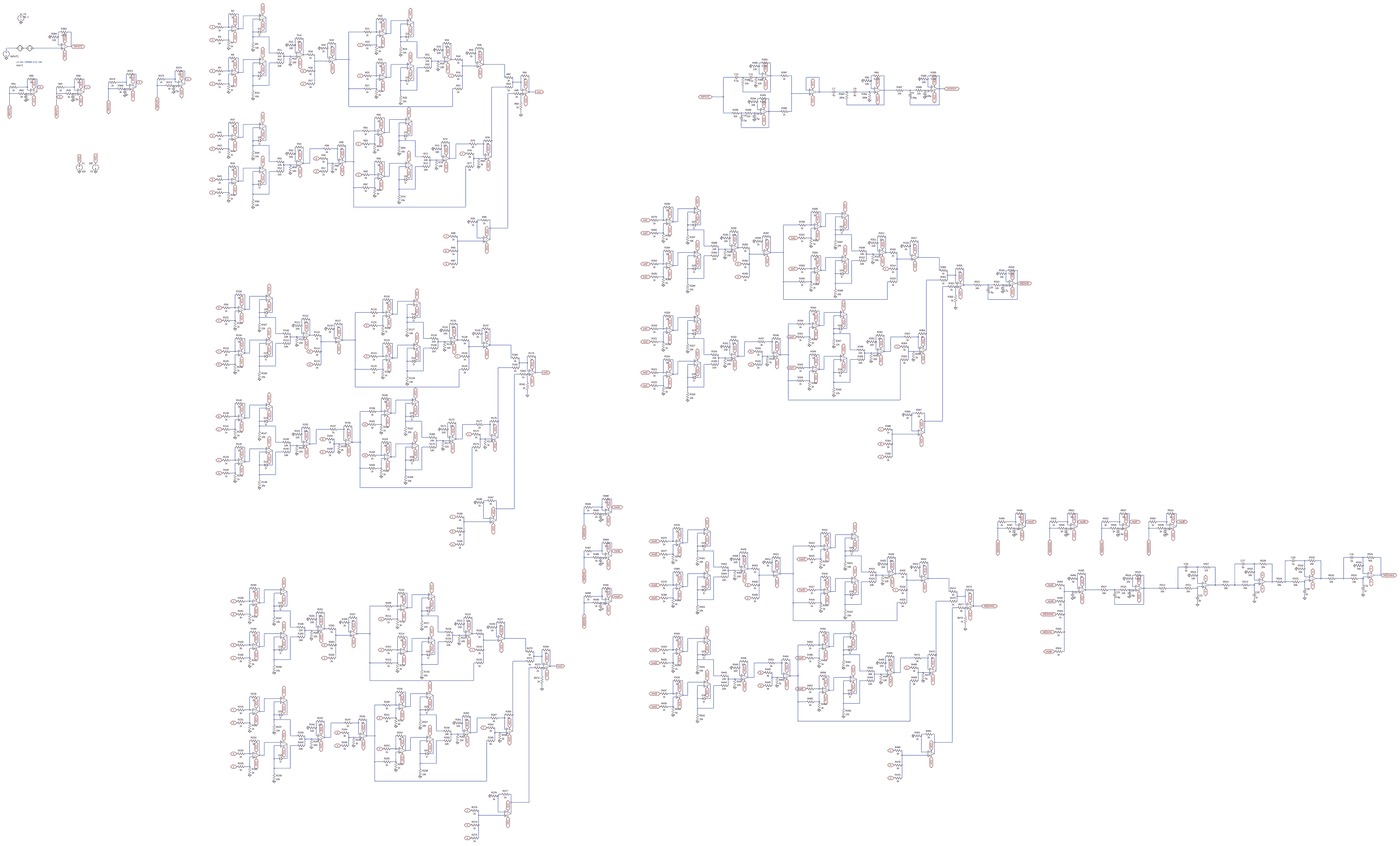
[diagram p0: schematic Median filter best.asc, whole sheet]
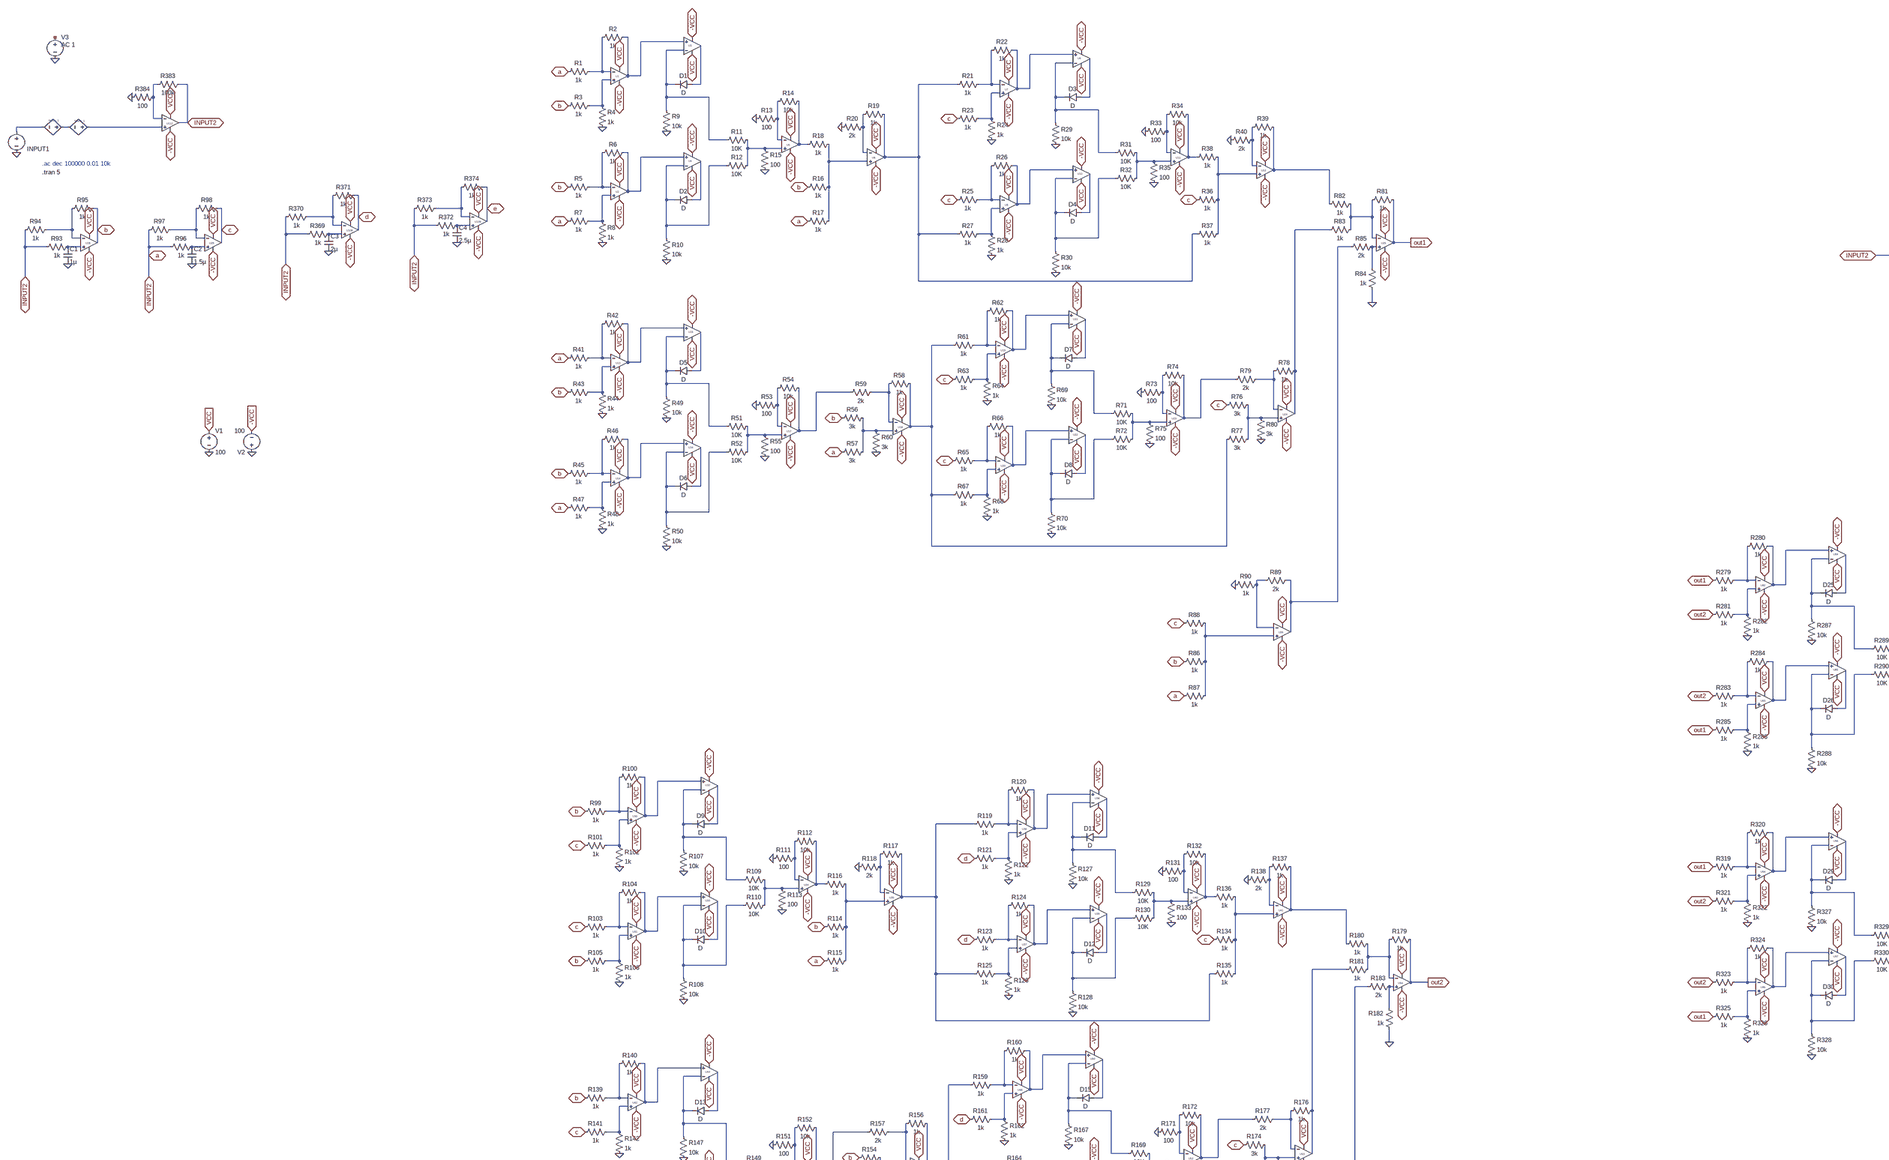
[diagram p1: schematic Median filter best.asc, part, row 1 of 2, column 1 of 2]
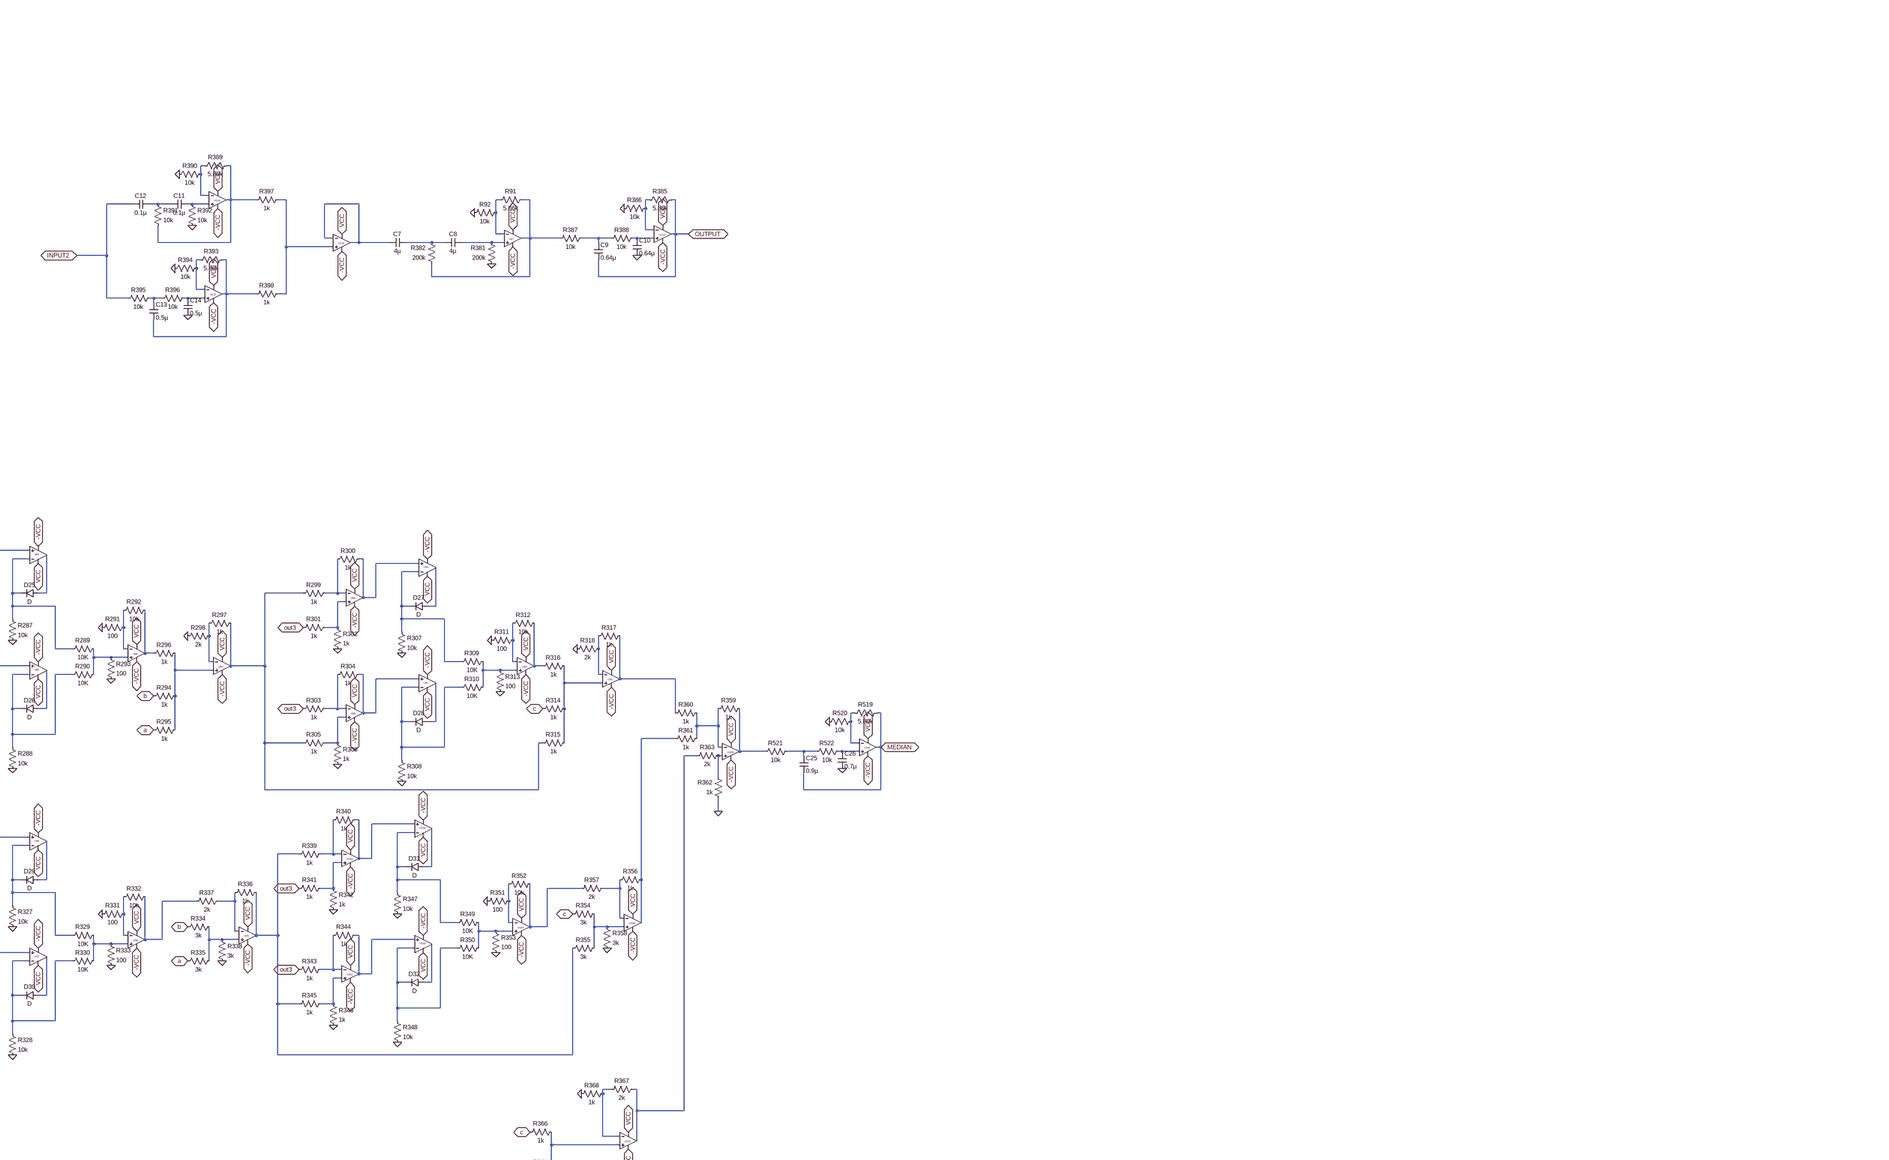
[diagram p2: schematic Median filter best.asc, part, row 1 of 2, column 2 of 2]
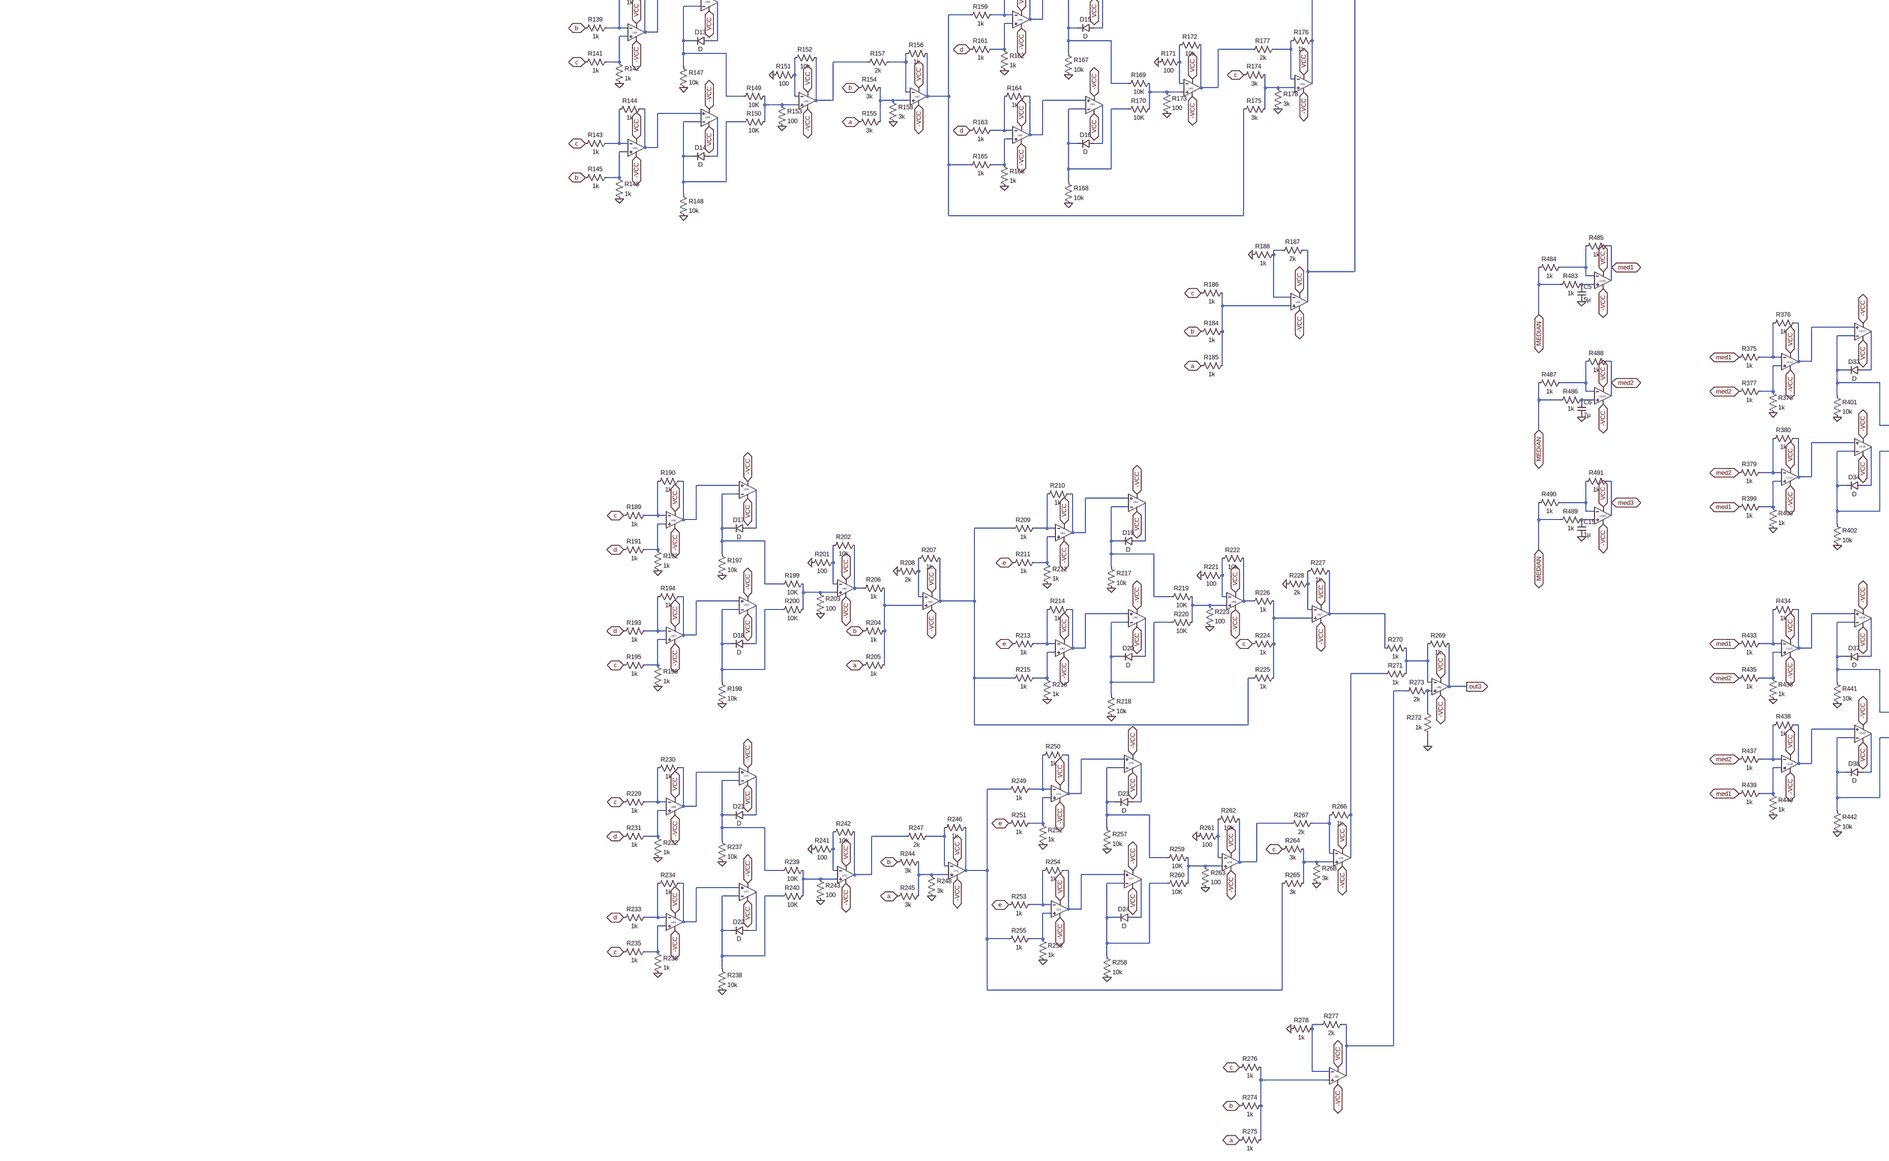
[diagram p3: schematic Median filter best.asc, part, row 2 of 2, column 1 of 2]
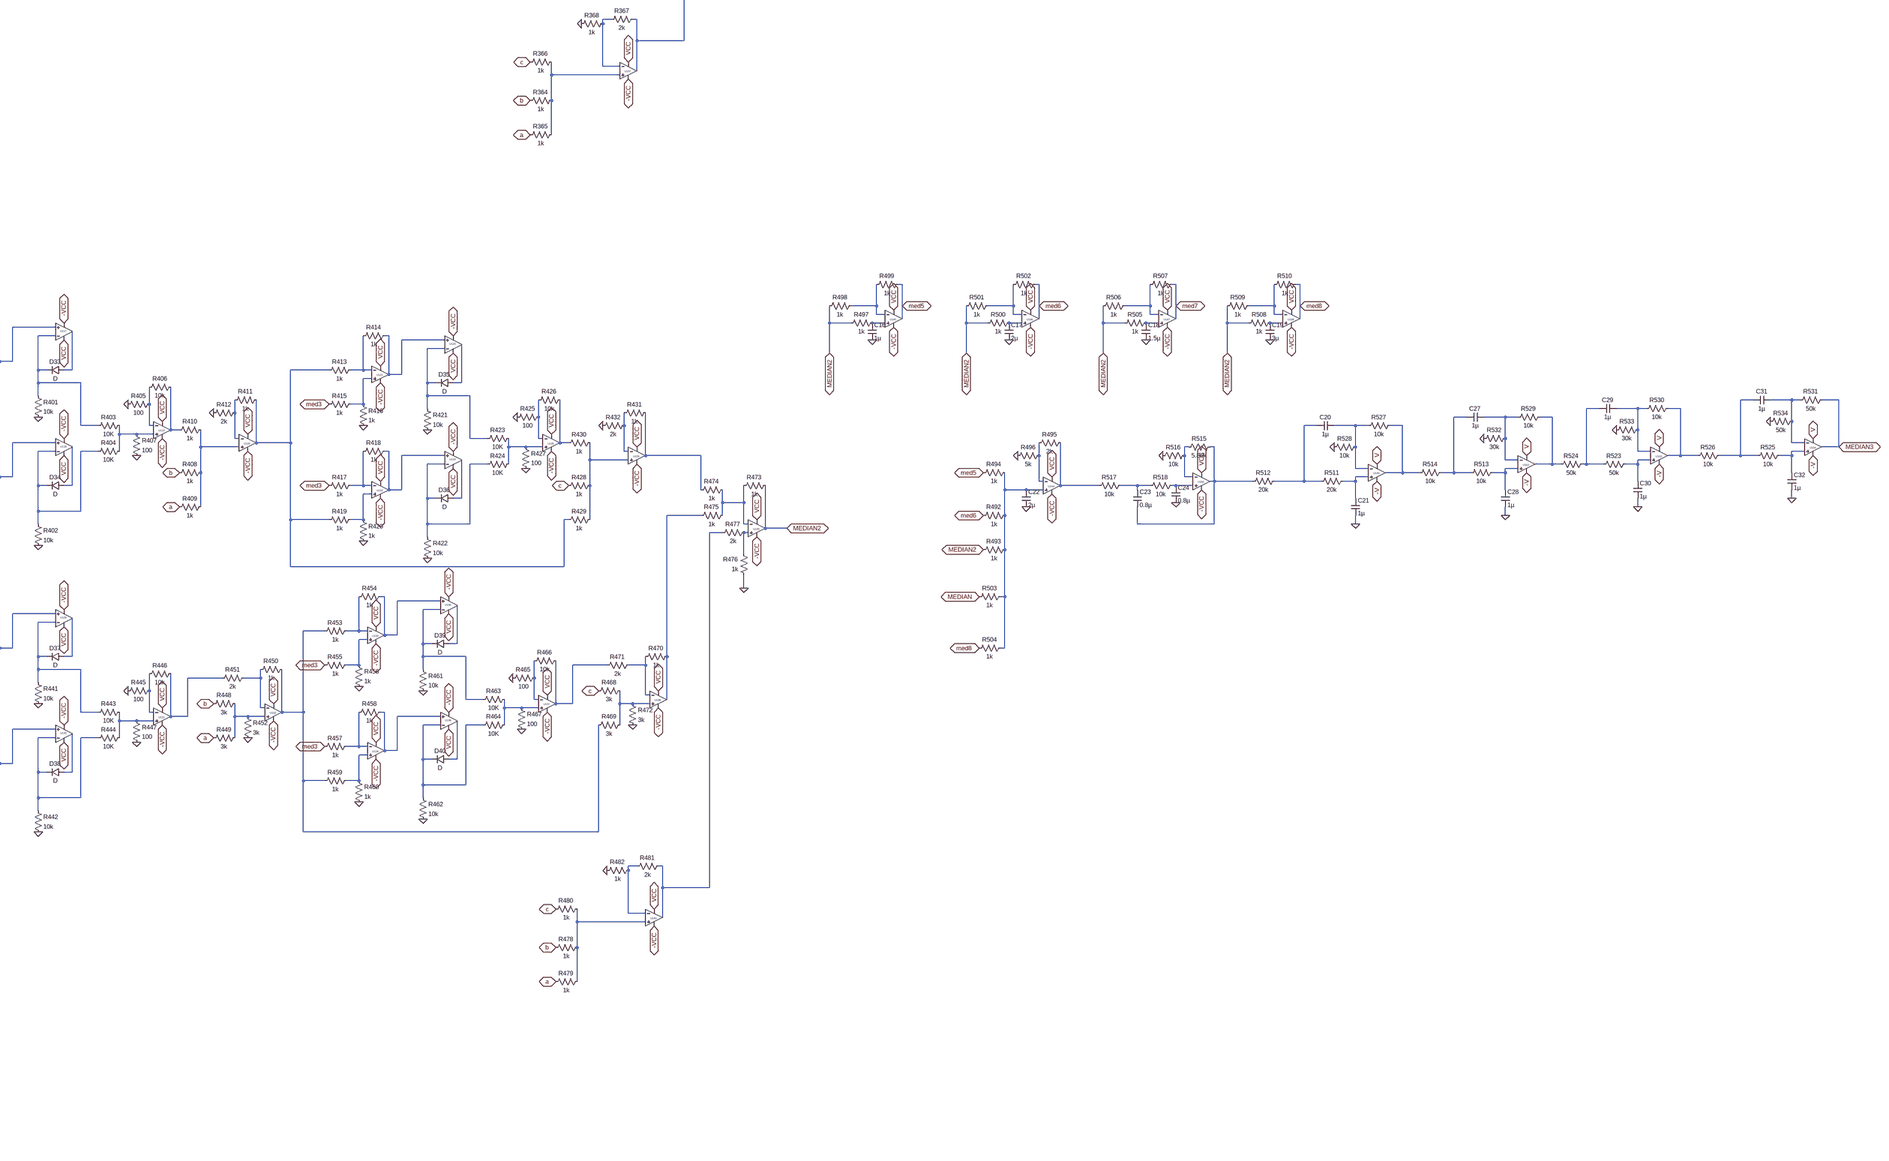
[diagram p4: schematic Median filter best.asc, part, row 2 of 2, column 2 of 2]
* Median filter best.asc
V1 VCC 0 100
V2 0 -VCC 100
XU1 N006 N005 VCC -VCC N001 level2 Avol=1Meg GBW=10Meg Slew=10Meg Ilimit=25m Rail=0 Vos=0 En=0 Enk=0 In=0 Ink=0 Rin=500Meg  ; pins In+ In- V+ V- OUT
R1 N005 INPUT2 1k
R2 N001 N005 1k
R3 N006 b 1k
R4 N006 0 1k
XU2 N034 N033 VCC -VCC N022 level2 Avol=1Meg GBW=10Meg Slew=10Meg Ilimit=25m Rail=0 Vos=0 En=0 Enk=0 In=0 Ink=0 Rin=500Meg  ; pins In+ In- V+ V- OUT
R5 N033 b 1k
R6 N022 N033 1k
R7 N034 INPUT2 1k
R8 N034 0 1k
XU3 N001 N002 VCC -VCC N008 level2 Avol=1Meg GBW=10Meg Slew=10Meg Ilimit=25m Rail=0 Vos=0 En=0 Enk=0 In=0 Ink=0 Rin=500Meg  ; pins In+ In- V+ V- OUT
R9 N002 0 10k
D1 N008 N002 D
XU4 N022 N026 VCC -VCC N035 level2 Avol=1Meg GBW=10Meg Slew=10Meg Ilimit=25m Rail=0 Vos=0 En=0 Enk=0 In=0 Ink=0 Rin=500Meg  ; pins In+ In- V+ V- OUT
R10 N026 0 10k
D2 N035 N026 D
R11 N021 N002 10K
R12 N021 N026 10K
XU5 N021 N013 VCC -VCC N020 level2 Avol=1Meg GBW=10Meg Slew=10Meg Ilimit=25m Rail=0 Vos=0 En=0 Enk=0 In=0 Ink=0 Rin=500Meg  ; pins In+ In- V+ V- OUT
R13 N013 0 100
R14 N020 N013 10k
R15 N021 0 100
R16 N024 b 1k
R17 N024 INPUT2 1k
R18 N024 N020 1k
XU6 N024 N017 VCC -VCC N009 level2 Avol=1Meg GBW=10Meg Slew=10Meg Ilimit=25m Rail=0 Vos=0 En=0 Enk=0 In=0 Ink=0 Rin=500Meg  ; pins In+ In- V+ V- OUT
R19 N009 N017 1k
R20 N017 0 2k
XU7 N011 N010 VCC -VCC N003 level2 Avol=1Meg GBW=10Meg Slew=10Meg Ilimit=25m Rail=0 Vos=0 En=0 Enk=0 In=0 Ink=0 Rin=500Meg  ; pins In+ In- V+ V- OUT
R21 N010 N009 1k
R22 N003 N010 1k
R23 N011 c 1k
R24 N011 0 1k
XU8 N045 N036 VCC -VCC N027 level2 Avol=1Meg GBW=10Meg Slew=10Meg Ilimit=25m Rail=0 Vos=0 En=0 Enk=0 In=0 Ink=0 Rin=500Meg  ; pins In+ In- V+ V- OUT
R25 N036 c 1k
R26 N027 N036 1k
R27 N045 N009 1k
R28 N045 0 1k
XU9 N003 N004 VCC -VCC N012 level2 Avol=1Meg GBW=10Meg Slew=10Meg Ilimit=25m Rail=0 Vos=0 En=0 Enk=0 In=0 Ink=0 Rin=500Meg  ; pins In+ In- V+ V- OUT
R29 N004 0 10k
D3 N012 N004 D
XU10 N027 N032 VCC -VCC N046 level2 Avol=1Meg GBW=10Meg Slew=10Meg Ilimit=25m Rail=0 Vos=0 En=0 Enk=0 In=0 Ink=0 Rin=500Meg  ; pins In+ In- V+ V- OUT
R30 N032 0 10k
D4 N046 N032 D
R31 N025 N004 10K
R32 N025 N032 10K
XU11 N025 N018 VCC -VCC N023 level2 Avol=1Meg GBW=10Meg Slew=10Meg Ilimit=25m Rail=0 Vos=0 En=0 Enk=0 In=0 Ink=0 Rin=500Meg  ; pins In+ In- V+ V- OUT
R33 N018 0 100
R34 N023 N018 10k
R35 N025 0 100
R36 N031 c 1k
R37 N031 N009 1k
R38 N031 N023 1k
XU12 N031 N019 VCC -VCC N030 level2 Avol=1Meg GBW=10Meg Slew=10Meg Ilimit=25m Rail=0 Vos=0 En=0 Enk=0 In=0 Ink=0 Rin=500Meg  ; pins In+ In- V+ V- OUT
R39 N030 N019 1k
R40 N019 0 2k
XU13 N075 N073 VCC -VCC N067 level2 Avol=1Meg GBW=10Meg Slew=10Meg Ilimit=25m Rail=0 Vos=0 En=0 Enk=0 In=0 Ink=0 Rin=500Meg  ; pins In+ In- V+ V- OUT
R41 N073 INPUT2 1k
R42 N067 N073 1k
R43 N075 b 1k
R44 N075 0 1k
XU14 N095 N093 VCC -VCC N088 level2 Avol=1Meg GBW=10Meg Slew=10Meg Ilimit=25m Rail=0 Vos=0 En=0 Enk=0 In=0 Ink=0 Rin=500Meg  ; pins In+ In- V+ V- OUT
R45 N093 b 1k
R46 N088 N093 1k
R47 N095 INPUT2 1k
R48 N095 0 1k
XU15 N067 N069 VCC -VCC N076 level2 Avol=1Meg GBW=10Meg Slew=10Meg Ilimit=25m Rail=0 Vos=0 En=0 Enk=0 In=0 Ink=0 Rin=500Meg  ; pins In+ In- V+ V- OUT
R49 N069 0 10k
D5 N076 N069 D
XU16 N088 N090 VCC -VCC N096 level2 Avol=1Meg GBW=10Meg Slew=10Meg Ilimit=25m Rail=0 Vos=0 En=0 Enk=0 In=0 Ink=0 Rin=500Meg  ; pins In+ In- V+ V- OUT
R50 N090 0 10k
D6 N096 N090 D
R51 N087 N069 10K
R52 N087 N090 10K
XU17 N087 N082 VCC -VCC N079 level2 Avol=1Meg GBW=10Meg Slew=10Meg Ilimit=25m Rail=0 Vos=0 En=0 Enk=0 In=0 Ink=0 Rin=500Meg  ; pins In+ In- V+ V- OUT
R53 N082 0 100
R54 N079 N082 10k
R55 N087 0 100
R56 N086 b 3k
R57 N086 INPUT2 3k
XU18 N086 N080 VCC -VCC N070 level2 Avol=1Meg GBW=10Meg Slew=10Meg Ilimit=25m Rail=0 Vos=0 En=0 Enk=0 In=0 Ink=0 Rin=500Meg  ; pins In+ In- V+ V- OUT
R58 N070 N080 1k
R59 N080 N079 2k
R60 N086 0 3k
XU19 N072 N071 VCC -VCC N066 level2 Avol=1Meg GBW=10Meg Slew=10Meg Ilimit=25m Rail=0 Vos=0 En=0 Enk=0 In=0 Ink=0 Rin=500Meg  ; pins In+ In- V+ V- OUT
R61 N071 N070 1k
R62 N066 N071 1k
R63 N072 c 1k
R64 N072 0 1k
XU20 N092 N091 VCC -VCC N085 level2 Avol=1Meg GBW=10Meg Slew=10Meg Ilimit=25m Rail=0 Vos=0 En=0 Enk=0 In=0 Ink=0 Rin=500Meg  ; pins In+ In- V+ V- OUT
R65 N091 c 1k
R66 N085 N091 1k
R67 N092 N070 1k
R68 N092 0 1k
XU21 N066 N068 VCC -VCC N074 level2 Avol=1Meg GBW=10Meg Slew=10Meg Ilimit=25m Rail=0 Vos=0 En=0 Enk=0 In=0 Ink=0 Rin=500Meg  ; pins In+ In- V+ V- OUT
R69 N068 0 10k
D7 N074 N068 D
XU22 N085 N089 VCC -VCC N094 level2 Avol=1Meg GBW=10Meg Slew=10Meg Ilimit=25m Rail=0 Vos=0 En=0 Enk=0 In=0 Ink=0 Rin=500Meg  ; pins In+ In- V+ V- OUT
R70 N089 0 10k
D8 N094 N089 D
R71 N084 N068 10K
R72 N084 N089 10K
XU23 N084 N081 VCC -VCC N077 level2 Avol=1Meg GBW=10Meg Slew=10Meg Ilimit=25m Rail=0 Vos=0 En=0 Enk=0 In=0 Ink=0 Rin=500Meg  ; pins In+ In- V+ V- OUT
R73 N081 0 100
R74 N077 N081 10k
R75 N084 0 100
R76 N083 c 3k
R77 N083 N070 3k
XU24 N083 N078 VCC -VCC N052 level2 Avol=1Meg GBW=10Meg Slew=10Meg Ilimit=25m Rail=0 Vos=0 En=0 Enk=0 In=0 Ink=0 Rin=500Meg  ; pins In+ In- V+ V- OUT
R78 N052 N078 1k
R79 N078 N077 2k
R80 N083 0 3k
XU25 N061 N048 VCC -VCC out1 level2 Avol=1Meg GBW=10Meg Slew=10Meg Ilimit=25m Rail=0 Vos=0 En=0 Enk=0 In=0 Ink=0 Rin=500Meg  ; pins In+ In- V+ V- OUT
R81 out1 N048 1k
R82 N048 N030 1k
R83 N048 N052 1k
R84 0 N061 1k
R85 N061 N060 2k
XU26 N110 N101 VCC -VCC N060 level2 Avol=1Meg GBW=10Meg Slew=10Meg Ilimit=25m Rail=0 Vos=0 En=0 Enk=0 In=0 Ink=0 Rin=500Meg  ; pins In+ In- V+ V- OUT
R86 N110 b 1k
R87 N110 INPUT2 1k
R88 N110 c 1k
R89 N060 N101 2k
R90 N101 0 1k
XU28 N058 N050 VCC -VCC b level2 Avol=1Meg GBW=10Meg Slew=10Meg Ilimit=25m Rail=0 Vos=0 En=0 Enk=0 In=0 Ink=0 Rin=500Meg  ; pins In+ In- V+ V- OUT
R93 N058 INPUT2 1k
C1 N058 0 1µ
R94 N050 INPUT2 1k
R95 b N050 1k
XU29 N059 N051 VCC -VCC c level2 Avol=1Meg GBW=10Meg Slew=10Meg Ilimit=25m Rail=0 Vos=0 En=0 Enk=0 In=0 Ink=0 Rin=500Meg  ; pins In+ In- V+ V- OUT
R96 N059 INPUT2 1k
C2 N059 0 1.5µ
R97 N051 INPUT2 1k
R98 c N051 1k
XU30 N144 N143 VCC -VCC N139 level2 Avol=1Meg GBW=10Meg Slew=10Meg Ilimit=25m Rail=0 Vos=0 En=0 Enk=0 In=0 Ink=0 Rin=500Meg  ; pins In+ In- V+ V- OUT
R99 N143 b 1k
R100 N139 N143 1k
R101 N144 c 1k
R102 N144 0 1k
XU31 N185 N182 VCC -VCC N169 level2 Avol=1Meg GBW=10Meg Slew=10Meg Ilimit=25m Rail=0 Vos=0 En=0 Enk=0 In=0 Ink=0 Rin=500Meg  ; pins In+ In- V+ V- OUT
R103 N182 c 1k
R104 N169 N182 1k
R105 N185 b 1k
R106 N185 0 1k
XU32 N139 N140 VCC -VCC N146 level2 Avol=1Meg GBW=10Meg Slew=10Meg Ilimit=25m Rail=0 Vos=0 En=0 Enk=0 In=0 Ink=0 Rin=500Meg  ; pins In+ In- V+ V- OUT
R107 N140 0 10k
D9 N146 N140 D
XU33 N169 N176 VCC -VCC N187 level2 Avol=1Meg GBW=10Meg Slew=10Meg Ilimit=25m Rail=0 Vos=0 En=0 Enk=0 In=0 Ink=0 Rin=500Meg  ; pins In+ In- V+ V- OUT
R108 N176 0 10k
D10 N187 N176 D
R109 N166 N140 10K
R110 N166 N176 10K
XU34 N166 N156 VCC -VCC N165 level2 Avol=1Meg GBW=10Meg Slew=10Meg Ilimit=25m Rail=0 Vos=0 En=0 Enk=0 In=0 Ink=0 Rin=500Meg  ; pins In+ In- V+ V- OUT
R111 N156 0 100
R112 N165 N156 10k
R113 N166 0 100
R114 N171 b 1k
R115 N171 INPUT2 1k
R116 N171 N165 1k
XU35 N171 N158 VCC -VCC N147 level2 Avol=1Meg GBW=10Meg Slew=10Meg Ilimit=25m Rail=0 Vos=0 En=0 Enk=0 In=0 Ink=0 Rin=500Meg  ; pins In+ In- V+ V- OUT
R117 N147 N158 1k
R118 N158 0 2k
XU36 N149 N148 VCC -VCC N141 level2 Avol=1Meg GBW=10Meg Slew=10Meg Ilimit=25m Rail=0 Vos=0 En=0 Enk=0 In=0 Ink=0 Rin=500Meg  ; pins In+ In- V+ V- OUT
R119 N148 N147 1k
R120 N141 N148 1k
R121 N149 d 1k
R122 N149 0 1k
XU37 N191 N188 VCC -VCC N177 level2 Avol=1Meg GBW=10Meg Slew=10Meg Ilimit=25m Rail=0 Vos=0 En=0 Enk=0 In=0 Ink=0 Rin=500Meg  ; pins In+ In- V+ V- OUT
R123 N188 d 1k
R124 N177 N188 1k
R125 N191 N147 1k
R126 N191 0 1k
XU38 N141 N142 VCC -VCC N152 level2 Avol=1Meg GBW=10Meg Slew=10Meg Ilimit=25m Rail=0 Vos=0 En=0 Enk=0 In=0 Ink=0 Rin=500Meg  ; pins In+ In- V+ V- OUT
R127 N142 0 10k
D11 N152 N142 D
XU39 N177 N181 VCC -VCC N194 level2 Avol=1Meg GBW=10Meg Slew=10Meg Ilimit=25m Rail=0 Vos=0 En=0 Enk=0 In=0 Ink=0 Rin=500Meg  ; pins In+ In- V+ V- OUT
R128 N181 0 10k
D12 N194 N181 D
R129 N172 N142 10K
R130 N172 N181 10K
XU40 N172 N161 VCC -VCC N170 level2 Avol=1Meg GBW=10Meg Slew=10Meg Ilimit=25m Rail=0 Vos=0 En=0 Enk=0 In=0 Ink=0 Rin=500Meg  ; pins In+ In- V+ V- OUT
R131 N161 0 100
R132 N170 N161 10k
R133 N172 0 100
R134 N179 c 1k
R135 N179 N147 1k
R136 N179 N170 1k
XU41 N179 N163 VCC -VCC N178 level2 Avol=1Meg GBW=10Meg Slew=10Meg Ilimit=25m Rail=0 Vos=0 En=0 Enk=0 In=0 Ink=0 Rin=500Meg  ; pins In+ In- V+ V- OUT
R137 N178 N163 1k
R138 N163 0 2k
XU42 N216 N214 VCC -VCC N207 level2 Avol=1Meg GBW=10Meg Slew=10Meg Ilimit=25m Rail=0 Vos=0 En=0 Enk=0 In=0 Ink=0 Rin=500Meg  ; pins In+ In- V+ V- OUT
R139 N214 b 1k
R140 N207 N214 1k
R141 N216 c 1k
R142 N216 0 1k
XU43 N237 N235 VCC -VCC N230 level2 Avol=1Meg GBW=10Meg Slew=10Meg Ilimit=25m Rail=0 Vos=0 En=0 Enk=0 In=0 Ink=0 Rin=500Meg  ; pins In+ In- V+ V- OUT
R143 N235 c 1k
R144 N230 N235 1k
R145 N237 b 1k
R146 N237 0 1k
XU44 N207 N209 VCC -VCC N217 level2 Avol=1Meg GBW=10Meg Slew=10Meg Ilimit=25m Rail=0 Vos=0 En=0 Enk=0 In=0 Ink=0 Rin=500Meg  ; pins In+ In- V+ V- OUT
R147 N209 0 10k
D13 N217 N209 D
XU45 N230 N232 VCC -VCC N238 level2 Avol=1Meg GBW=10Meg Slew=10Meg Ilimit=25m Rail=0 Vos=0 En=0 Enk=0 In=0 Ink=0 Rin=500Meg  ; pins In+ In- V+ V- OUT
R148 N232 0 10k
D14 N238 N232 D
R149 N229 N209 10K
R150 N229 N232 10K
XU46 N229 N223 VCC -VCC N220 level2 Avol=1Meg GBW=10Meg Slew=10Meg Ilimit=25m Rail=0 Vos=0 En=0 Enk=0 In=0 Ink=0 Rin=500Meg  ; pins In+ In- V+ V- OUT
R151 N223 0 100
R152 N220 N223 10k
R153 N229 0 100
R154 N228 b 3k
R155 N228 INPUT2 3k
XU47 N228 N221 VCC -VCC N210 level2 Avol=1Meg GBW=10Meg Slew=10Meg Ilimit=25m Rail=0 Vos=0 En=0 Enk=0 In=0 Ink=0 Rin=500Meg  ; pins In+ In- V+ V- OUT
R156 N210 N221 1k
R157 N221 N220 2k
R158 N228 0 3k
XU48 N213 N211 VCC -VCC N206 level2 Avol=1Meg GBW=10Meg Slew=10Meg Ilimit=25m Rail=0 Vos=0 En=0 Enk=0 In=0 Ink=0 Rin=500Meg  ; pins In+ In- V+ V- OUT
R159 N211 N210 1k
R160 N206 N211 1k
R161 N213 d 1k
R162 N213 0 1k
XU49 N234 N233 VCC -VCC N227 level2 Avol=1Meg GBW=10Meg Slew=10Meg Ilimit=25m Rail=0 Vos=0 En=0 Enk=0 In=0 Ink=0 Rin=500Meg  ; pins In+ In- V+ V- OUT
R163 N233 d 1k
R164 N227 N233 1k
R165 N234 N210 1k
R166 N234 0 1k
XU50 N206 N208 VCC -VCC N215 level2 Avol=1Meg GBW=10Meg Slew=10Meg Ilimit=25m Rail=0 Vos=0 En=0 Enk=0 In=0 Ink=0 Rin=500Meg  ; pins In+ In- V+ V- OUT
R167 N208 0 10k
D15 N215 N208 D
XU51 N227 N231 VCC -VCC N236 level2 Avol=1Meg GBW=10Meg Slew=10Meg Ilimit=25m Rail=0 Vos=0 En=0 Enk=0 In=0 Ink=0 Rin=500Meg  ; pins In+ In- V+ V- OUT
R168 N231 0 10k
D16 N236 N231 D
R169 N226 N208 10K
R170 N226 N231 10K
XU52 N226 N222 VCC -VCC N218 level2 Avol=1Meg GBW=10Meg Slew=10Meg Ilimit=25m Rail=0 Vos=0 En=0 Enk=0 In=0 Ink=0 Rin=500Meg  ; pins In+ In- V+ V- OUT
R171 N222 0 100
R172 N218 N222 10k
R173 N226 0 100
R174 N225 c 3k
R175 N225 N210 3k
XU53 N225 N219 VCC -VCC N197 level2 Avol=1Meg GBW=10Meg Slew=10Meg Ilimit=25m Rail=0 Vos=0 En=0 Enk=0 In=0 Ink=0 Rin=500Meg  ; pins In+ In- V+ V- OUT
R176 N197 N219 1k
R177 N219 N218 2k
R178 N225 0 3k
XU54 N203 N195 VCC -VCC out2 level2 Avol=1Meg GBW=10Meg Slew=10Meg Ilimit=25m Rail=0 Vos=0 En=0 Enk=0 In=0 Ink=0 Rin=500Meg  ; pins In+ In- V+ V- OUT
R179 out2 N195 1k
R180 N195 N178 1k
R181 N195 N197 1k
R182 0 N203 1k
R183 N203 N202 2k
XU55 N242 N239 VCC -VCC N202 level2 Avol=1Meg GBW=10Meg Slew=10Meg Ilimit=25m Rail=0 Vos=0 En=0 Enk=0 In=0 Ink=0 Rin=500Meg  ; pins In+ In- V+ V- OUT
R184 N242 b 1k
R185 N242 INPUT2 1k
R186 N242 c 1k
R187 N202 N239 2k
R188 N239 0 1k
XU56 N316 N313 VCC -VCC N298 level2 Avol=1Meg GBW=10Meg Slew=10Meg Ilimit=25m Rail=0 Vos=0 En=0 Enk=0 In=0 Ink=0 Rin=500Meg  ; pins In+ In- V+ V- OUT
R189 N313 c 1k
R190 N298 N313 1k
R191 N316 d 1k
R192 N316 0 1k
XU57 N346 N343 VCC -VCC N330 level2 Avol=1Meg GBW=10Meg Slew=10Meg Ilimit=25m Rail=0 Vos=0 En=0 Enk=0 In=0 Ink=0 Rin=500Meg  ; pins In+ In- V+ V- OUT
R193 N343 d 1k
R194 N330 N343 1k
R195 N346 c 1k
R196 N346 0 1k
XU58 N298 N306 VCC -VCC N317 level2 Avol=1Meg GBW=10Meg Slew=10Meg Ilimit=25m Rail=0 Vos=0 En=0 Enk=0 In=0 Ink=0 Rin=500Meg  ; pins In+ In- V+ V- OUT
R197 N306 0 10k
D17 N317 N306 D
XU59 N330 N335 VCC -VCC N348 level2 Avol=1Meg GBW=10Meg Slew=10Meg Ilimit=25m Rail=0 Vos=0 En=0 Enk=0 In=0 Ink=0 Rin=500Meg  ; pins In+ In- V+ V- OUT
R198 N335 0 10k
D18 N348 N335 D
R199 N329 N306 10K
R200 N329 N335 10K
XU60 N329 N324 VCC -VCC N328 level2 Avol=1Meg GBW=10Meg Slew=10Meg Ilimit=25m Rail=0 Vos=0 En=0 Enk=0 In=0 Ink=0 Rin=500Meg  ; pins In+ In- V+ V- OUT
R201 N324 0 100
R202 N328 N324 10k
R203 N329 0 100
R204 N333 b 1k
R205 N333 INPUT2 1k
R206 N333 N328 1k
XU61 N333 N325 VCC -VCC N318 level2 Avol=1Meg GBW=10Meg Slew=10Meg Ilimit=25m Rail=0 Vos=0 En=0 Enk=0 In=0 Ink=0 Rin=500Meg  ; pins In+ In- V+ V- OUT
R207 N318 N325 1k
R208 N325 0 2k
XU62 N322 N319 VCC -VCC N307 level2 Avol=1Meg GBW=10Meg Slew=10Meg Ilimit=25m Rail=0 Vos=0 En=0 Enk=0 In=0 Ink=0 Rin=500Meg  ; pins In+ In- V+ V- OUT
R209 N319 N318 1k
R210 N307 N319 1k
R211 N322 e 1k
R212 N322 0 1k
XU63 N352 N349 VCC -VCC N336 level2 Avol=1Meg GBW=10Meg Slew=10Meg Ilimit=25m Rail=0 Vos=0 En=0 Enk=0 In=0 Ink=0 Rin=500Meg  ; pins In+ In- V+ V- OUT
R213 N349 e 1k
R214 N336 N349 1k
R215 N352 N318 1k
R216 N352 0 1k
XU64 N307 N312 VCC -VCC N323 level2 Avol=1Meg GBW=10Meg Slew=10Meg Ilimit=25m Rail=0 Vos=0 En=0 Enk=0 In=0 Ink=0 Rin=500Meg  ; pins In+ In- V+ V- OUT
R217 N312 0 10k
D19 N323 N312 D
XU65 N336 N341 VCC -VCC N354 level2 Avol=1Meg GBW=10Meg Slew=10Meg Ilimit=25m Rail=0 Vos=0 En=0 Enk=0 In=0 Ink=0 Rin=500Meg  ; pins In+ In- V+ V- OUT
R218 N341 0 10k
D20 N354 N341 D
R219 N334 N312 10K
R220 N334 N341 10K
XU66 N334 N326 VCC -VCC N332 level2 Avol=1Meg GBW=10Meg Slew=10Meg Ilimit=25m Rail=0 Vos=0 En=0 Enk=0 In=0 Ink=0 Rin=500Meg  ; pins In+ In- V+ V- OUT
R221 N326 0 100
R222 N332 N326 10k
R223 N334 0 100
R224 N340 c 1k
R225 N340 N318 1k
R226 N340 N332 1k
XU67 N340 N327 VCC -VCC N339 level2 Avol=1Meg GBW=10Meg Slew=10Meg Ilimit=25m Rail=0 Vos=0 En=0 Enk=0 In=0 Ink=0 Rin=500Meg  ; pins In+ In- V+ V- OUT
R227 N339 N327 1k
R228 N327 0 2k
XU68 N389 N387 VCC -VCC N379 level2 Avol=1Meg GBW=10Meg Slew=10Meg Ilimit=25m Rail=0 Vos=0 En=0 Enk=0 In=0 Ink=0 Rin=500Meg  ; pins In+ In- V+ V- OUT
R229 N387 c 1k
R230 N379 N387 1k
R231 N389 d 1k
R232 N389 0 1k
XU69 N411 N408 VCC -VCC N403 level2 Avol=1Meg GBW=10Meg Slew=10Meg Ilimit=25m Rail=0 Vos=0 En=0 Enk=0 In=0 Ink=0 Rin=500Meg  ; pins In+ In- V+ V- OUT
R233 N408 d 1k
R234 N403 N408 1k
R235 N411 c 1k
R236 N411 0 1k
XU70 N379 N383 VCC -VCC N390 level2 Avol=1Meg GBW=10Meg Slew=10Meg Ilimit=25m Rail=0 Vos=0 En=0 Enk=0 In=0 Ink=0 Rin=500Meg  ; pins In+ In- V+ V- OUT
R237 N383 0 10k
D21 N390 N383 D
XU71 N403 N405 VCC -VCC N412 level2 Avol=1Meg GBW=10Meg Slew=10Meg Ilimit=25m Rail=0 Vos=0 En=0 Enk=0 In=0 Ink=0 Rin=500Meg  ; pins In+ In- V+ V- OUT
R238 N405 0 10k
D22 N412 N405 D
R239 N402 N383 10K
R240 N402 N405 10K
XU72 N402 N396 VCC -VCC N393 level2 Avol=1Meg GBW=10Meg Slew=10Meg Ilimit=25m Rail=0 Vos=0 En=0 Enk=0 In=0 Ink=0 Rin=500Meg  ; pins In+ In- V+ V- OUT
R241 N396 0 100
R242 N393 N396 10k
R243 N402 0 100
R244 N401 b 3k
R245 N401 INPUT2 3k
XU73 N401 N394 VCC -VCC N384 level2 Avol=1Meg GBW=10Meg Slew=10Meg Ilimit=25m Rail=0 Vos=0 En=0 Enk=0 In=0 Ink=0 Rin=500Meg  ; pins In+ In- V+ V- OUT
R246 N384 N394 1k
R247 N394 N393 2k
R248 N401 0 3k
XU74 N386 N385 VCC -VCC N375 level2 Avol=1Meg GBW=10Meg Slew=10Meg Ilimit=25m Rail=0 Vos=0 En=0 Enk=0 In=0 Ink=0 Rin=500Meg  ; pins In+ In- V+ V- OUT
R249 N385 N384 1k
R250 N375 N385 1k
R251 N386 e 1k
R252 N386 0 1k
XU75 N407 N406 VCC -VCC N400 level2 Avol=1Meg GBW=10Meg Slew=10Meg Ilimit=25m Rail=0 Vos=0 En=0 Enk=0 In=0 Ink=0 Rin=500Meg  ; pins In+ In- V+ V- OUT
R253 N406 e 1k
R254 N400 N406 1k
R255 N407 N384 1k
R256 N407 0 1k
XU76 N375 N380 VCC -VCC N388 level2 Avol=1Meg GBW=10Meg Slew=10Meg Ilimit=25m Rail=0 Vos=0 En=0 Enk=0 In=0 Ink=0 Rin=500Meg  ; pins In+ In- V+ V- OUT
R257 N380 0 10k
D23 N388 N380 D
XU77 N400 N404 VCC -VCC N409 level2 Avol=1Meg GBW=10Meg Slew=10Meg Ilimit=25m Rail=0 Vos=0 En=0 Enk=0 In=0 Ink=0 Rin=500Meg  ; pins In+ In- V+ V- OUT
R258 N404 0 10k
D24 N409 N404 D
R259 N398 N380 10K
R260 N398 N404 10K
XU78 N398 N395 VCC -VCC N391 level2 Avol=1Meg GBW=10Meg Slew=10Meg Ilimit=25m Rail=0 Vos=0 En=0 Enk=0 In=0 Ink=0 Rin=500Meg  ; pins In+ In- V+ V- OUT
R261 N395 0 100
R262 N391 N395 10k
R263 N398 0 100
R264 N397 c 3k
R265 N397 N384 3k
XU79 N397 N392 VCC -VCC N359 level2 Avol=1Meg GBW=10Meg Slew=10Meg Ilimit=25m Rail=0 Vos=0 En=0 Enk=0 In=0 Ink=0 Rin=500Meg  ; pins In+ In- V+ V- OUT
R266 N359 N392 1k
R267 N392 N391 2k
R268 N397 0 3k
XU80 N364 N356 VCC -VCC out3 level2 Avol=1Meg GBW=10Meg Slew=10Meg Ilimit=25m Rail=0 Vos=0 En=0 Enk=0 In=0 Ink=0 Rin=500Meg  ; pins In+ In- V+ V- OUT
R269 out3 N356 1k
R270 N356 N339 1k
R271 N356 N359 1k
R272 0 N364 1k
R273 N364 N363 2k
XU81 N414 N413 VCC -VCC N363 level2 Avol=1Meg GBW=10Meg Slew=10Meg Ilimit=25m Rail=0 Vos=0 En=0 Enk=0 In=0 Ink=0 Rin=500Meg  ; pins In+ In- V+ V- OUT
R274 N414 b 1k
R275 N414 INPUT2 1k
R276 N414 c 1k
R277 N363 N413 2k
R278 N413 0 1k
XU82 N103 N102 VCC -VCC N097 level2 Avol=1Meg GBW=10Meg Slew=10Meg Ilimit=25m Rail=0 Vos=0 En=0 Enk=0 In=0 Ink=0 Rin=500Meg  ; pins In+ In- V+ V- OUT
R279 N102 out1 1k
R280 N097 N102 1k
R281 N103 out2 1k
R282 N103 0 1k
XU83 N126 N125 VCC -VCC N116 level2 Avol=1Meg GBW=10Meg Slew=10Meg Ilimit=25m Rail=0 Vos=0 En=0 Enk=0 In=0 Ink=0 Rin=500Meg  ; pins In+ In- V+ V- OUT
R283 N125 out2 1k
R284 N116 N125 1k
R285 N126 out1 1k
R286 N126 0 1k
XU84 N097 N098 VCC -VCC N104 level2 Avol=1Meg GBW=10Meg Slew=10Meg Ilimit=25m Rail=0 Vos=0 En=0 Enk=0 In=0 Ink=0 Rin=500Meg  ; pins In+ In- V+ V- OUT
R287 N098 0 10k
D25 N104 N098 D
XU85 N116 N120 VCC -VCC N127 level2 Avol=1Meg GBW=10Meg Slew=10Meg Ilimit=25m Rail=0 Vos=0 En=0 Enk=0 In=0 Ink=0 Rin=500Meg  ; pins In+ In- V+ V- OUT
R288 N120 0 10k
D26 N127 N120 D
R289 N115 N098 10K
R290 N115 N120 10K
XU86 N115 N109 VCC -VCC N114 level2 Avol=1Meg GBW=10Meg Slew=10Meg Ilimit=25m Rail=0 Vos=0 En=0 Enk=0 In=0 Ink=0 Rin=500Meg  ; pins In+ In- V+ V- OUT
R291 N109 0 100
R292 N114 N109 10k
R293 N115 0 100
R294 N118 b 1k
R295 N118 INPUT2 1k
R296 N118 N114 1k
XU87 N118 N111 VCC -VCC N105 level2 Avol=1Meg GBW=10Meg Slew=10Meg Ilimit=25m Rail=0 Vos=0 En=0 Enk=0 In=0 Ink=0 Rin=500Meg  ; pins In+ In- V+ V- OUT
R297 N105 N111 1k
R298 N111 0 2k
XU88 N107 N106 VCC -VCC N099 level2 Avol=1Meg GBW=10Meg Slew=10Meg Ilimit=25m Rail=0 Vos=0 En=0 Enk=0 In=0 Ink=0 Rin=500Meg  ; pins In+ In- V+ V- OUT
R299 N106 N105 1k
R300 N099 N106 1k
R301 N107 out3 1k
R302 N107 0 1k
XU89 N130 N128 VCC -VCC N121 level2 Avol=1Meg GBW=10Meg Slew=10Meg Ilimit=25m Rail=0 Vos=0 En=0 Enk=0 In=0 Ink=0 Rin=500Meg  ; pins In+ In- V+ V- OUT
R303 N128 out3 1k
R304 N121 N128 1k
R305 N130 N105 1k
R306 N130 0 1k
XU90 N099 N100 VCC -VCC N108 level2 Avol=1Meg GBW=10Meg Slew=10Meg Ilimit=25m Rail=0 Vos=0 En=0 Enk=0 In=0 Ink=0 Rin=500Meg  ; pins In+ In- V+ V- OUT
R307 N100 0 10k
D27 N108 N100 D
XU91 N121 N124 VCC -VCC N131 level2 Avol=1Meg GBW=10Meg Slew=10Meg Ilimit=25m Rail=0 Vos=0 En=0 Enk=0 In=0 Ink=0 Rin=500Meg  ; pins In+ In- V+ V- OUT
R308 N124 0 10k
D28 N131 N124 D
R309 N119 N100 10K
R310 N119 N124 10K
XU92 N119 N112 VCC -VCC N117 level2 Avol=1Meg GBW=10Meg Slew=10Meg Ilimit=25m Rail=0 Vos=0 En=0 Enk=0 In=0 Ink=0 Rin=500Meg  ; pins In+ In- V+ V- OUT
R311 N112 0 100
R312 N117 N112 10k
R313 N119 0 100
R314 N123 c 1k
R315 N123 N105 1k
R316 N123 N117 1k
XU93 N123 N113 VCC -VCC N122 level2 Avol=1Meg GBW=10Meg Slew=10Meg Ilimit=25m Rail=0 Vos=0 En=0 Enk=0 In=0 Ink=0 Rin=500Meg  ; pins In+ In- V+ V- OUT
R317 N122 N113 1k
R318 N113 0 2k
XU94 N162 N159 VCC -VCC N150 level2 Avol=1Meg GBW=10Meg Slew=10Meg Ilimit=25m Rail=0 Vos=0 En=0 Enk=0 In=0 Ink=0 Rin=500Meg  ; pins In+ In- V+ V- OUT
R319 N159 out1 1k
R320 N150 N159 1k
R321 N162 out2 1k
R322 N162 0 1k
XU95 N204 N200 VCC -VCC N192 level2 Avol=1Meg GBW=10Meg Slew=10Meg Ilimit=25m Rail=0 Vos=0 En=0 Enk=0 In=0 Ink=0 Rin=500Meg  ; pins In+ In- V+ V- OUT
R323 N200 out2 1k
R324 N192 N200 1k
R325 N204 out1 1k
R326 N204 0 1k
XU96 N150 N153 VCC -VCC N164 level2 Avol=1Meg GBW=10Meg Slew=10Meg Ilimit=25m Rail=0 Vos=0 En=0 Enk=0 In=0 Ink=0 Rin=500Meg  ; pins In+ In- V+ V- OUT
R327 N153 0 10k
D29 N164 N153 D
XU97 N192 N196 VCC -VCC N205 level2 Avol=1Meg GBW=10Meg Slew=10Meg Ilimit=25m Rail=0 Vos=0 En=0 Enk=0 In=0 Ink=0 Rin=500Meg  ; pins In+ In- V+ V- OUT
R328 N196 0 10k
D30 N205 N196 D
R329 N190 N153 10K
R330 N190 N196 10K
XU98 N190 N180 VCC -VCC N173 level2 Avol=1Meg GBW=10Meg Slew=10Meg Ilimit=25m Rail=0 Vos=0 En=0 Enk=0 In=0 Ink=0 Rin=500Meg  ; pins In+ In- V+ V- OUT
R331 N180 0 100
R332 N173 N180 10k
R333 N190 0 100
R334 N189 b 3k
R335 N189 INPUT2 3k
XU99 N189 N174 VCC -VCC N154 level2 Avol=1Meg GBW=10Meg Slew=10Meg Ilimit=25m Rail=0 Vos=0 En=0 Enk=0 In=0 Ink=0 Rin=500Meg  ; pins In+ In- V+ V- OUT
R336 N154 N174 1k
R337 N174 N173 2k
R338 N189 0 3k
XU100 N157 N155 VCC -VCC N145 level2 Avol=1Meg GBW=10Meg Slew=10Meg Ilimit=25m Rail=0 Vos=0 En=0 Enk=0 In=0 Ink=0 Rin=500Meg  ; pins In+ In- V+ V- OUT
R339 N155 N154 1k
R340 N145 N155 1k
R341 N157 out3 1k
R342 N157 0 1k
XU101 N199 N198 VCC -VCC N186 level2 Avol=1Meg GBW=10Meg Slew=10Meg Ilimit=25m Rail=0 Vos=0 En=0 Enk=0 In=0 Ink=0 Rin=500Meg  ; pins In+ In- V+ V- OUT
R343 N198 out3 1k
R344 N186 N198 1k
R345 N199 N154 1k
R346 N199 0 1k
XU102 N145 N151 VCC -VCC N160 level2 Avol=1Meg GBW=10Meg Slew=10Meg Ilimit=25m Rail=0 Vos=0 En=0 Enk=0 In=0 Ink=0 Rin=500Meg  ; pins In+ In- V+ V- OUT
R347 N151 0 10k
D31 N160 N151 D
XU103 N186 N193 VCC -VCC N201 level2 Avol=1Meg GBW=10Meg Slew=10Meg Ilimit=25m Rail=0 Vos=0 En=0 Enk=0 In=0 Ink=0 Rin=500Meg  ; pins In+ In- V+ V- OUT
R348 N193 0 10k
D32 N201 N193 D
R349 N184 N151 10K
R350 N184 N193 10K
XU104 N184 N175 VCC -VCC N167 level2 Avol=1Meg GBW=10Meg Slew=10Meg Ilimit=25m Rail=0 Vos=0 En=0 Enk=0 In=0 Ink=0 Rin=500Meg  ; pins In+ In- V+ V- OUT
R351 N175 0 100
R352 N167 N175 10k
R353 N184 0 100
R354 N183 c 3k
R355 N183 N154 3k
XU105 N183 N168 VCC -VCC N133 level2 Avol=1Meg GBW=10Meg Slew=10Meg Ilimit=25m Rail=0 Vos=0 En=0 Enk=0 In=0 Ink=0 Rin=500Meg  ; pins In+ In- V+ V- OUT
R356 N133 N168 1k
R357 N168 N167 2k
R358 N183 0 3k
XU106 N138 N132 VCC -VCC N134 level2 Avol=1Meg GBW=10Meg Slew=10Meg Ilimit=25m Rail=0 Vos=0 En=0 Enk=0 In=0 Ink=0 Rin=500Meg  ; pins In+ In- V+ V- OUT
R359 N134 N132 1k
R360 N132 N122 1k
R361 N132 N133 1k
R362 0 N138 1k
R363 N138 N137 2k
XU107 N224 N212 VCC -VCC N137 level2 Avol=1Meg GBW=10Meg Slew=10Meg Ilimit=25m Rail=0 Vos=0 En=0 Enk=0 In=0 Ink=0 Rin=500Meg  ; pins In+ In- V+ V- OUT
R364 N224 b 1k
R365 N224 INPUT2 1k
R366 N224 c 1k
R367 N137 N212 2k
R368 N212 0 1k
XU108 N053 N047 VCC -VCC d level2 Avol=1Meg GBW=10Meg Slew=10Meg Ilimit=25m Rail=0 Vos=0 En=0 Enk=0 In=0 Ink=0 Rin=500Meg  ; pins In+ In- V+ V- OUT
R369 N053 INPUT2 1k
C3 N053 0 2µ
R370 N047 INPUT2 1k
R371 d N047 1k
XU109 N049 N044 VCC -VCC e level2 Avol=1Meg GBW=10Meg Slew=10Meg Ilimit=25m Rail=0 Vos=0 En=0 Enk=0 In=0 Ink=0 Rin=500Meg  ; pins In+ In- V+ V- OUT
R372 N049 INPUT2 1k
C4 N049 0 2.5µ
R373 N044 INPUT2 1k
R374 e N044 1k
XU27 N057 N038 VCC -VCC N039 level2 Avol=1Meg GBW=10Meg Slew=10Meg Ilimit=25m Rail=0 Vos=0 En=0 Enk=0 In=0 Ink=0 Rin=500Meg  ; pins In+ In- V+ V- OUT
R91 N039 N038 5.86k
R92 N038 0 10k
R381 0 N057 200k
C7 N056 N043 4µ
C8 N057 N056 4µ
R382 N039 N056 200k
XU112 N016 N007 VCC -VCC INPUT2 level2 Avol=1Meg GBW=10Meg Slew=10Meg Ilimit=25m Rail=0 Vos=0 En=0 Enk=0 In=0 Ink=0 Rin=500Meg  ; pins In+ In- V+ V- OUT
R383 INPUT2 N007 100k
R384 N007 0 100
V§INPUT1 N014 0 PWL file="C:\Users\Varad\Downloads\data (1).txt"
XU113 N055 N040 VCC -VCC OUTPUT level2 Avol=1Meg GBW=10Meg Slew=10Meg Ilimit=25m Rail=0 Vos=0 En=0 Enk=0 In=0 Ink=0 Rin=500Meg  ; pins In+ In- V+ V- OUT
R385 N040 OUTPUT 5.86k
R386 0 N040 10k
R387 N054 N039 10k
R388 N055 N054 10k
C9 N054 OUTPUT 0.64µ
C10 N055 0 0.64µ
B§Noise_1 N015 N014 V=WHITE(314*time)*0.0002
B§Nosie_1 N016 N015 V= idt(white(0.628*time))*0.00001
XU114 N042 N028 VCC -VCC N029 level2 Avol=1Meg GBW=10Meg Slew=10Meg Ilimit=25m Rail=0 Vos=0 En=0 Enk=0 In=0 Ink=0 Rin=500Meg  ; pins In+ In- V+ V- OUT
R389 N028 N029 5.86k
R390 0 N028 10k
R391 N041 N029 10k
R392 N042 0 10k
C11 N042 N041 0.1µ
C12 N041 INPUT2 0.1µ
XU115 N065 N062 VCC -VCC N063 level2 Avol=1Meg GBW=10Meg Slew=10Meg Ilimit=25m Rail=0 Vos=0 En=0 Enk=0 In=0 Ink=0 Rin=500Meg  ; pins In+ In- V+ V- OUT
R393 N062 N063 5.86k
R394 0 N062 10k
R395 N064 INPUT2 10k
R396 N065 N064 10k
C13 N064 N063 0.5µ
C14 N065 0 0.5µ
XU116 N037 N043 VCC -VCC N043 level2 Avol=1Meg GBW=10Meg Slew=10Meg Ilimit=25m Rail=0 Vos=0 En=0 Enk=0 In=0 Ink=0 Rin=500Meg  ; pins In+ In- V+ V- OUT
R397 N037 N029 1k
R398 N037 N063 1k
XU110 N256 N255 VCC -VCC N247 level2 Avol=1Meg GBW=10Meg Slew=10Meg Ilimit=25m Rail=0 Vos=0 En=0 Enk=0 In=0 Ink=0 Rin=500Meg  ; pins In+ In- V+ V- OUT
R375 N255 med1 1k
R376 N247 N255 1k
R377 N256 med2 1k
R378 N256 0 1k
XU111 N299 N296 VCC -VCC N281 level2 Avol=1Meg GBW=10Meg Slew=10Meg Ilimit=25m Rail=0 Vos=0 En=0 Enk=0 In=0 Ink=0 Rin=500Meg  ; pins In+ In- V+ V- OUT
R379 N296 med2 1k
R380 N281 N296 1k
R399 N299 med1 1k
R400 N299 0 1k
XU117 N247 N252 VCC -VCC N257 level2 Avol=1Meg GBW=10Meg Slew=10Meg Ilimit=25m Rail=0 Vos=0 En=0 Enk=0 In=0 Ink=0 Rin=500Meg  ; pins In+ In- V+ V- OUT
R401 N252 0 10k
D33 N257 N252 D
XU118 N281 N287 VCC -VCC N300 level2 Avol=1Meg GBW=10Meg Slew=10Meg Ilimit=25m Rail=0 Vos=0 En=0 Enk=0 In=0 Ink=0 Rin=500Meg  ; pins In+ In- V+ V- OUT
R402 N287 0 10k
D34 N300 N287 D
R403 N280 N252 10K
R404 N280 N287 10K
XU119 N280 N266 VCC -VCC N279 level2 Avol=1Meg GBW=10Meg Slew=10Meg Ilimit=25m Rail=0 Vos=0 En=0 Enk=0 In=0 Ink=0 Rin=500Meg  ; pins In+ In- V+ V- OUT
R405 N266 0 100
R406 N279 N266 10k
R407 N280 0 100
R408 N283 b 1k
R409 N283 INPUT2 1k
R410 N283 N279 1k
XU120 N283 N270 VCC -VCC N258 level2 Avol=1Meg GBW=10Meg Slew=10Meg Ilimit=25m Rail=0 Vos=0 En=0 Enk=0 In=0 Ink=0 Rin=500Meg  ; pins In+ In- V+ V- OUT
R411 N258 N270 1k
R412 N270 0 2k
XU121 N260 N259 VCC -VCC N253 level2 Avol=1Meg GBW=10Meg Slew=10Meg Ilimit=25m Rail=0 Vos=0 En=0 Enk=0 In=0 Ink=0 Rin=500Meg  ; pins In+ In- V+ V- OUT
R413 N259 N258 1k
R414 N253 N259 1k
R415 N260 med3 1k
R416 N260 0 1k
XU122 N308 N301 VCC -VCC N288 level2 Avol=1Meg GBW=10Meg Slew=10Meg Ilimit=25m Rail=0 Vos=0 En=0 Enk=0 In=0 Ink=0 Rin=500Meg  ; pins In+ In- V+ V- OUT
R417 N301 med3 1k
R418 N288 N301 1k
R419 N308 N258 1k
R420 N308 0 1k
XU123 N253 N254 VCC -VCC N262 level2 Avol=1Meg GBW=10Meg Slew=10Meg Ilimit=25m Rail=0 Vos=0 En=0 Enk=0 In=0 Ink=0 Rin=500Meg  ; pins In+ In- V+ V- OUT
R421 N254 0 10k
D35 N262 N254 D
XU124 N288 N294 VCC -VCC N309 level2 Avol=1Meg GBW=10Meg Slew=10Meg Ilimit=25m Rail=0 Vos=0 En=0 Enk=0 In=0 Ink=0 Rin=500Meg  ; pins In+ In- V+ V- OUT
R422 N294 0 10k
D36 N309 N294 D
R423 N284 N254 10K
R424 N284 N294 10K
XU125 N284 N271 VCC -VCC N282 level2 Avol=1Meg GBW=10Meg Slew=10Meg Ilimit=25m Rail=0 Vos=0 En=0 Enk=0 In=0 Ink=0 Rin=500Meg  ; pins In+ In- V+ V- OUT
R425 N271 0 100
R426 N282 N271 10k
R427 N284 0 100
R428 N292 c 1k
R429 N292 N258 1k
R430 N292 N282 1k
XU126 N292 N275 VCC -VCC N290 level2 Avol=1Meg GBW=10Meg Slew=10Meg Ilimit=25m Rail=0 Vos=0 En=0 Enk=0 In=0 Ink=0 Rin=500Meg  ; pins In+ In- V+ V- OUT
R431 N290 N275 1k
R432 N275 0 2k
XU127 N353 N350 VCC -VCC N337 level2 Avol=1Meg GBW=10Meg Slew=10Meg Ilimit=25m Rail=0 Vos=0 En=0 Enk=0 In=0 Ink=0 Rin=500Meg  ; pins In+ In- V+ V- OUT
R433 N350 med1 1k
R434 N337 N350 1k
R435 N353 med2 1k
R436 N353 0 1k
XU128 N381 N377 VCC -VCC N371 level2 Avol=1Meg GBW=10Meg Slew=10Meg Ilimit=25m Rail=0 Vos=0 En=0 Enk=0 In=0 Ink=0 Rin=500Meg  ; pins In+ In- V+ V- OUT
R437 N377 med2 1k
R438 N371 N377 1k
R439 N381 med1 1k
R440 N381 0 1k
XU129 N337 N342 VCC -VCC N355 level2 Avol=1Meg GBW=10Meg Slew=10Meg Ilimit=25m Rail=0 Vos=0 En=0 Enk=0 In=0 Ink=0 Rin=500Meg  ; pins In+ In- V+ V- OUT
R441 N342 0 10k
D37 N355 N342 D
XU130 N371 N373 VCC -VCC N382 level2 Avol=1Meg GBW=10Meg Slew=10Meg Ilimit=25m Rail=0 Vos=0 En=0 Enk=0 In=0 Ink=0 Rin=500Meg  ; pins In+ In- V+ V- OUT
R442 N373 0 10k
D38 N382 N373 D
R443 N370 N342 10K
R444 N370 N373 10K
XU131 N370 N365 VCC -VCC N360 level2 Avol=1Meg GBW=10Meg Slew=10Meg Ilimit=25m Rail=0 Vos=0 En=0 Enk=0 In=0 Ink=0 Rin=500Meg  ; pins In+ In- V+ V- OUT
R445 N365 0 100
R446 N360 N365 10k
R447 N370 0 100
R448 N369 b 3k
R449 N369 INPUT2 3k
XU132 N369 N361 VCC -VCC N344 level2 Avol=1Meg GBW=10Meg Slew=10Meg Ilimit=25m Rail=0 Vos=0 En=0 Enk=0 In=0 Ink=0 Rin=500Meg  ; pins In+ In- V+ V- OUT
R450 N344 N361 1k
R451 N361 N360 2k
R452 N369 0 3k
XU133 N347 N345 VCC -VCC N331 level2 Avol=1Meg GBW=10Meg Slew=10Meg Ilimit=25m Rail=0 Vos=0 En=0 Enk=0 In=0 Ink=0 Rin=500Meg  ; pins In+ In- V+ V- OUT
R453 N345 N344 1k
R454 N331 N345 1k
R455 N347 med3 1k
R456 N347 0 1k
XU134 N376 N374 VCC -VCC N368 level2 Avol=1Meg GBW=10Meg Slew=10Meg Ilimit=25m Rail=0 Vos=0 En=0 Enk=0 In=0 Ink=0 Rin=500Meg  ; pins In+ In- V+ V- OUT
R457 N374 med3 1k
R458 N368 N374 1k
R459 N376 N344 1k
R460 N376 0 1k
XU135 N331 N338 VCC -VCC N351 level2 Avol=1Meg GBW=10Meg Slew=10Meg Ilimit=25m Rail=0 Vos=0 En=0 Enk=0 In=0 Ink=0 Rin=500Meg  ; pins In+ In- V+ V- OUT
R461 N338 0 10k
D39 N351 N338 D
XU136 N368 N372 VCC -VCC N378 level2 Avol=1Meg GBW=10Meg Slew=10Meg Ilimit=25m Rail=0 Vos=0 En=0 Enk=0 In=0 Ink=0 Rin=500Meg  ; pins In+ In- V+ V- OUT
R462 N372 0 10k
D40 N378 N372 D
R463 N367 N338 10K
R464 N367 N372 10K
XU137 N367 N362 VCC -VCC N357 level2 Avol=1Meg GBW=10Meg Slew=10Meg Ilimit=25m Rail=0 Vos=0 En=0 Enk=0 In=0 Ink=0 Rin=500Meg  ; pins In+ In- V+ V- OUT
R465 N362 0 100
R466 N357 N362 10k
R467 N367 0 100
R468 N366 c 3k
R469 N366 N344 3k
XU138 N366 N358 VCC -VCC N314 level2 Avol=1Meg GBW=10Meg Slew=10Meg Ilimit=25m Rail=0 Vos=0 En=0 Enk=0 In=0 Ink=0 Rin=500Meg  ; pins In+ In- V+ V- OUT
R470 N314 N358 1k
R471 N358 N357 2k
R472 N366 0 3k
XU139 N321 N311 VCC -VCC MEDIAN2 level2 Avol=1Meg GBW=10Meg Slew=10Meg Ilimit=25m Rail=0 Vos=0 En=0 Enk=0 In=0 Ink=0 Rin=500Meg  ; pins In+ In- V+ V- OUT
R473 MEDIAN2 N311 1k
R474 N311 N290 1k
R475 N311 N314 1k
R476 0 N321 1k
R477 N321 N320 2k
XU140 N410 N399 VCC -VCC N320 level2 Avol=1Meg GBW=10Meg Slew=10Meg Ilimit=25m Rail=0 Vos=0 En=0 Enk=0 In=0 Ink=0 Rin=500Meg  ; pins In+ In- V+ V- OUT
R478 N410 b 1k
R479 N410 INPUT2 1k
R480 N410 c 1k
R481 N320 N399 2k
R482 N399 0 1k
XU141 N241 N240 VCC -VCC med1 level2 Avol=1Meg GBW=10Meg Slew=10Meg Ilimit=25m Rail=0 Vos=0 En=0 Enk=0 In=0 Ink=0 Rin=500Meg  ; pins In+ In- V+ V- OUT
R483 N241 MEDIAN 1k
C5 N241 0 5µ
R484 N240 MEDIAN 1k
R485 med1 N240 1k
XU142 N263 N261 VCC -VCC med2 level2 Avol=1Meg GBW=10Meg Slew=10Meg Ilimit=25m Rail=0 Vos=0 En=0 Enk=0 In=0 Ink=0 Rin=500Meg  ; pins In+ In- V+ V- OUT
R486 N263 MEDIAN 1k
C6 N263 0 7µ
R487 N261 MEDIAN 1k
R488 med2 N261 1k
XU143 N315 N310 VCC -VCC med3 level2 Avol=1Meg GBW=10Meg Slew=10Meg Ilimit=25m Rail=0 Vos=0 En=0 Enk=0 In=0 Ink=0 Rin=500Meg  ; pins In+ In- V+ V- OUT
R489 N315 MEDIAN 1k
C15 N315 0 1µ
R490 N310 MEDIAN 1k
R491 med3 N310 1k
R492 N305 med6 1k
R493 N305 MEDIAN2 1k
R494 N305 med5 1k
XU144 N305 N291 VCC -VCC N302 level2 Avol=1Meg GBW=10Meg Slew=10Meg Ilimit=25m Rail=0 Vos=0 En=0 Enk=0 In=0 Ink=0 Rin=500Meg  ; pins In+ In- V+ V- OUT
R495 N302 N291 2k
R496 N291 0 5k
XU145 N248 N243 VCC -VCC med5 level2 Avol=1Meg GBW=10Meg Slew=10Meg Ilimit=25m Rail=0 Vos=0 En=0 Enk=0 In=0 Ink=0 Rin=500Meg  ; pins In+ In- V+ V- OUT
R497 N248 MEDIAN2 1k
C16 N248 0 1µ
R498 N243 MEDIAN2 1k
R499 med5 N243 1k
XU146 N249 N244 VCC -VCC med6 level2 Avol=1Meg GBW=10Meg Slew=10Meg Ilimit=25m Rail=0 Vos=0 En=0 Enk=0 In=0 Ink=0 Rin=500Meg  ; pins In+ In- V+ V- OUT
R500 N249 MEDIAN2 1k
C17 N249 0 2µ
R501 N244 MEDIAN2 1k
R502 med6 N244 1k
R503 N305 MEDIAN 1k
R504 N305 med8 1k
XU147 N250 N245 VCC -VCC med7 level2 Avol=1Meg GBW=10Meg Slew=10Meg Ilimit=25m Rail=0 Vos=0 En=0 Enk=0 In=0 Ink=0 Rin=500Meg  ; pins In+ In- V+ V- OUT
R505 N250 MEDIAN2 1k
C18 N250 0 1.5µ
R506 N245 MEDIAN2 1k
R507 med7 N245 1k
XU148 N251 N246 VCC -VCC med8 level2 Avol=1Meg GBW=10Meg Slew=10Meg Ilimit=25m Rail=0 Vos=0 En=0 Enk=0 In=0 Ink=0 Rin=500Meg  ; pins In+ In- V+ V- OUT
R508 N251 MEDIAN2 1k
C19 N251 0 3µ
R509 N246 MEDIAN2 1k
R510 med8 N246 1k
V3 NC_01 0 AC 1
C22 N305 0 2µ
XU150 N304 N285 VCC -VCC N286 level2 Avol=1Meg GBW=10Meg Slew=10Meg Ilimit=25m Rail=0 Vos=0 En=0 Enk=0 In=0 Ink=0 Rin=500Meg  ; pins In+ In- V+ V- OUT
R515 N285 N286 5.86k
R516 0 N285 10k
R517 N303 N302 10k
R518 N304 N303 10k
C23 N303 N286 0.8µ
C24 N304 0 0.8µ
XU149 N297 N277 V -V N278 level2 Avol=1Meg GBW=10Meg Slew=10Meg Ilimit=25m Rail=0 Vos=0 En=0 Enk=0 In=0 Ink=0 Rin=500Meg  ; pins In+ In- V+ V- OUT
R511 N297 N276 20k
R512 N276 N286 20k
C20 N277 N276 1µ
C21 N297 0 1µ
XU152 N295 N273 V -V N274 level2 Avol=1Meg GBW=10Meg Slew=10Meg Ilimit=25m Rail=0 Vos=0 En=0 Enk=0 In=0 Ink=0 Rin=500Meg  ; pins In+ In- V+ V- OUT
R513 N295 N272 10k
R514 N272 N278 10k
C27 N273 N272 1µ
C28 N295 0 1µ
XU153 N293 N268 V -V N269 level2 Avol=1Meg GBW=10Meg Slew=10Meg Ilimit=25m Rail=0 Vos=0 En=0 Enk=0 In=0 Ink=0 Rin=500Meg  ; pins In+ In- V+ V- OUT
R523 N293 N267 50k
R524 N267 N274 50k
C29 N268 N267 1µ
C30 N293 0 1µ
XU154 N289 N265 V -V MEDIAN3 level2 Avol=1Meg GBW=10Meg Slew=10Meg Ilimit=25m Rail=0 Vos=0 En=0 Enk=0 In=0 Ink=0 Rin=500Meg  ; pins In+ In- V+ V- OUT
R525 N289 N264 10k
R526 N264 N269 10k
C31 N265 N264 1µ
C32 N289 0 1µ
R527 N278 N277 10k
R528 N277 0 10k
R529 N274 N273 10k
R530 N269 N268 10k
R531 MEDIAN3 N265 50k
R532 N273 0 30k
R533 N268 0 30k
R534 N265 0 50k
XU151 N136 N129 VCC -VCC MEDIAN level2 Avol=1Meg GBW=10Meg Slew=10Meg Ilimit=25m Rail=0 Vos=0 En=0 Enk=0 In=0 Ink=0 Rin=500Meg  ; pins In+ In- V+ V- OUT
R519 N129 MEDIAN 5.86k
R520 0 N129 10k
R521 N135 N134 10k
R522 N136 N135 10k
C25 N135 MEDIAN 0.9µ
C26 N136 0 0.7µ
.model D D
.lib standard.dio
.tran 5
* .ac dec 100000 0.01 10k
.lib UniversalOpAmp2.lib
.backanno
.end